# EAGLE design emonPi_V1.6 (EAGLE 7.3.0)
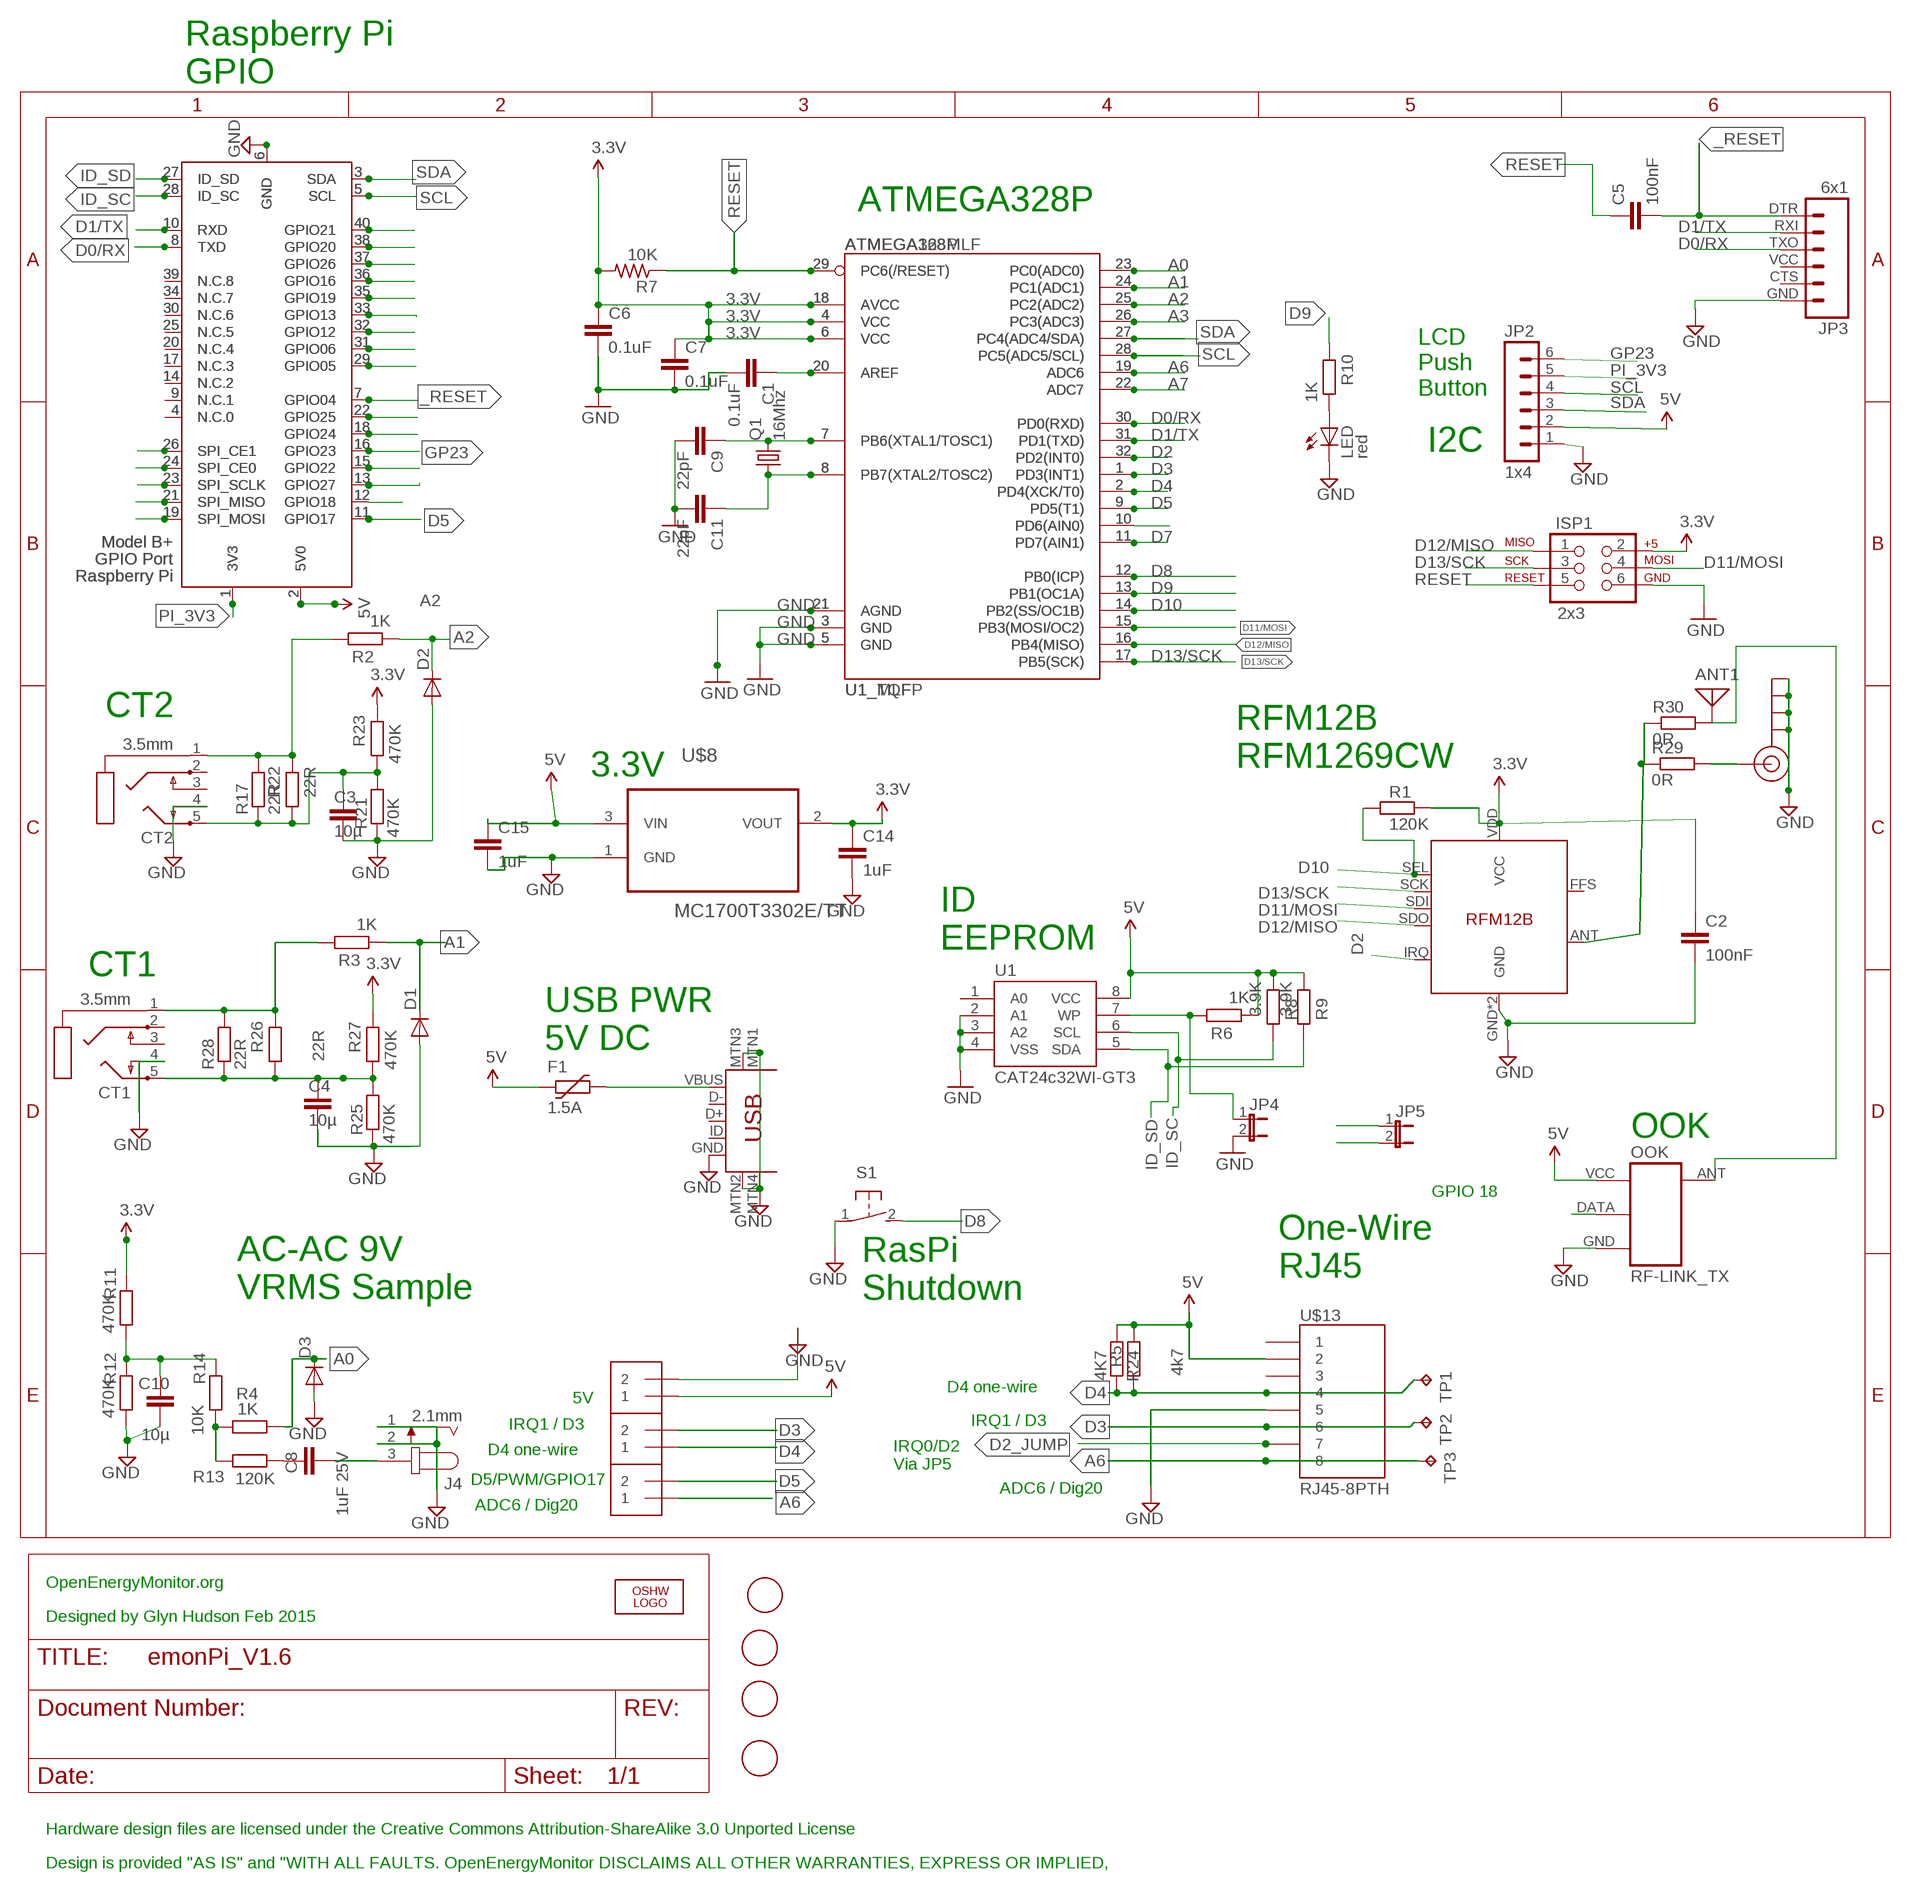
[diagram p0: schematic, sheet 1]

## Parts
ANT1  ANTENNA  [PAD-01]
C1  0.1uF  C-EUC0603  [C0603]
C2  100nF  C-EUC0603  [C0603]
C3  10µ  C-EUC0603  [C0603]
C4  10µ  C-EUC0603  [C0603]
C5  100nF  C-EUC0603  [C0603]
C6  0.1uF  C-EUC0603  [C0603]
C7  0.1uF  C-EUC0603  [C0603]
C8  1uF 25V  C-EUC0603  [C0603]
C9  22pF  C-EUC0603  [C0603]
C10  10µ  C-EUC0603  [C0603]
C11  22pF  C-EUC0603  [C0603]
C14  1uF  C-EUC0603  [C0603]
C15  1uF  C-EUC0603  [C0603]
CT1  3.5mm  STEREOJACK  [STX3100]
CT2  3.5mm  STEREOJACK  [STX3100]
D1  DIODE-SOD523  [SOD523]
D2  DIODE-SOD523  [SOD523]
D3  DIODE-SOD523  [SOD523]
F1  1.5A  FUSE_PTC-1812  [PTC1812L]
ISP1  2x3  AVR_SPI_PRG_6PTH  [2X3]
J1  1X2-3.5MM  [1X2-3.5MM]
J2  1X2-3.5MM  [1X2-3.5MM]
J3  1X2-3.5MM  [1X2-3.5MM]
J4  2.1mm  JACK-PLUG0  [SPC4077]
J$1  SMA_EDGE  [SMA-EDGE]
JP2  1x4  MA06-1  [MA06-1]
JP3  6x1  FTDI_BASICPTH  [FTDI_BASIC]
JP4  JUMPER-2PTH  [1X02]
JP5  JUMPER-2PTH  [1X02]
LED  red  LEDCHIPLED_0805  [CHIPLED_0805]
LOGO1  OSHW_LOGO_10MILX0200-NT  [OSHW_10X200_NOTEXT]
OOK  RF-LINK_TX  [RF-LINK_TX]
Q1  16Mhz  CRYSTALHC49UP  [HC49UP]
R1  120K  R-EU_R0603  [R0603]
R2  1K  R-EU_R0603  [R0603]
R3  1K  R-EU_R0603  [R0603]
R4  1K  R-EU_R0603  [R0603]
R5  4k7  R-EU_0204/7  [0204/7]
R6  1K  R-EU_R0603  [R0603]
R7  10K  R-US_R0603  [R0603]
R8  3.9K  R-EU_R0603  [R0603]
R9  3.9K  R-EU_R0603  [R0603]
R10  1K  R-EU_R0603  [R0603]
R11  470K  R-EU_R0603  [R0603]
R12  470K  R-EU_R0603  [R0603]
R13  120K  R-EU_R0603  [R0603]
R14  10K  R-EU_R0603  [R0603]
R17  22R  R-EU_R1206  [R1206]
R21  470K  R-EU_R0603  [R0603]
R22  22R  R-EU_0204/7  [0204/7]
R23  470K  R-EU_R0603  [R0603]
R24  4K7  R-EU_R0603  [R0603]
R25  470K  R-EU_R0603  [R0603]
R26  22R  R-EU_0204/7  [0204/7]
R27  470K  R-EU_R0603  [R0603]
R28  22R  R-EU_R1206  [R1206]
R29  0R  R-EU_R0603  [R0603]
R30  0R  R-EU_R0603  [R0603]
S1  31-XX  [B3F-31XX]
TP1  TPPAD1-13  [P1-13]
TP2  TPPAD1-13  [P1-13]
TP3  TPPAD1-13  [P1-13]
U1  CAT24c32WI-GT3  EEPROM-I2CSMD  [SO08]
U1_MLF  ATMEGA168MLF  [MLF32]
U1_TQFP  ATMEGA328P  ATMEGA328_SMT  [TQFP32-08]
U$1  FIDUCIAL  [FIDUCIAL_1MM]
U$3  FIDUCIAL  [FIDUCIAL_1MM]
U$4  FIDUCIAL  [FIDUCIAL_1MM]
U$5  FIDUCIAL  [FIDUCIAL_1MM]
U$7  USB-MINIB-5PIN  [USB-MINIB-CISECO]
U$8  MC1700T3302E/TT  MCP1700T-3302E/TT  [SOT95P237X112-3N]
U$13  RJ45-8PTH  [RJ45-8]
U$14  RFM12B  [RFM12B]
X1  RASPI_GPIO_B+_SMT  [RASPI_SMT_GPIO_B+_PIN]
X4  RASPI_GPIO_B+_PIN  [RASPI_GPIO_B+_PIN]

## Nets
3.3V [power]: C2.1 C6.1 C7.1 C14.1 ISP1.2 R1.2 R7.2 R11.2 R23.2 R27.2 U1_MLF.4(VCC) U1_MLF.6(VCC) U1_MLF.18(AVCC) U1_TQFP.4(VCC) U1_TQFP.6(VCC) U1_TQFP.18(AVCC) U$8.2(VOUT) U$14.VDD(VCC)
5V: C15.1 F1.1 J1.1 JP2.2 OOK.VCC(+5V) R5.2 R6.1 R8.1 R9.1 R24.1 U1.8(VCC) U$8.3(VIN) U$13.2 X1.2(5V0) X4.2(5V0)
_RESET: C5.2 JP3.DTR X1.7(GPIO04) X4.7(GPIO04)
A0: D3.C R4.1 U1_MLF.23(PC0(ADC0)) U1_TQFP.23(PC0(ADC0))
A1: D1.C R3.1 U1_MLF.24(PC1(ADC1)) U1_TQFP.24(PC1(ADC1))
A2: D2.C R2.1 U1_MLF.25(PC2(ADC2)) U1_TQFP.25(PC2(ADC2))
A3: U1_MLF.26(PC3(ADC3)) U1_TQFP.26(PC3(ADC3))
A6: J3.1 TP3.TP U1_MLF.19(ADC6) U1_TQFP.19(ADC6) U$13.8
A7: U1_MLF.22(ADC7) U1_TQFP.22(ADC7)
D0/RX: JP3.TXO U1_MLF.30(PD0(RXD)) U1_TQFP.30(PD0(RXD)) X1.8(TXD) X4.8(TXD)
D1/TX: JP3.RXI U1_MLF.31(PD1(TXD)) U1_TQFP.31(PD1(TXD)) X1.10(RXD) X4.10(RXD)
D2: JP5.1 U1_MLF.32(PD2(INT0)) U1_TQFP.32(PD2(INT0)) U$14.IRQ
D2_JUMP: JP5.2 U$13.7
D3: J2.2 TP2.TP U1_MLF.1(PD3(INT1)) U1_TQFP.1(PD3(INT1)) U$13.6
D4: J2.1 R5.1 R24.2 TP1.TP U1_MLF.2(PD4(XCK/T0)) U1_TQFP.2(PD4(XCK/T0)) U$13.4
D5: J3.2 U1_MLF.9(PD5(T1)) U1_TQFP.9(PD5(T1)) X1.11(GPIO17) X4.11(GPIO17)
D6: U1_MLF.10(PD6(AIN0)) U1_TQFP.10(PD6(AIN0))
D7: U1_MLF.11(PD7(AIN1)) U1_TQFP.11(PD7(AIN1))
D8: S1.2(S) U1_MLF.12(PB0(ICP)) U1_TQFP.12(PB0(ICP))
D9: R10.2 U1_MLF.13(PB1(OC1A)) U1_TQFP.13(PB1(OC1A))
D10: R1.1 U1_MLF.14(PB2(SS/OC1B)) U1_TQFP.14(PB2(SS/OC1B)) U$14.SEL
D11/MOSI: ISP1.4 U1_MLF.15(PB3(MOSI/OC2)) U1_TQFP.15(PB3(MOSI/OC2)) U$14.SDI
D12/MISO: ISP1.1 U1_MLF.16(PB4(MISO)) U1_TQFP.16(PB4(MISO)) U$14.SDO
D13/SCK: ISP1.3 U1_MLF.17(PB5(SCK)) U1_TQFP.17(PB5(SCK)) U$14.SCK
DIG6: R29.1 R30.1 U$14.ANT
GND [gnd]: C1.2 C2.2 C3.2 C4.2 C6.2 C7.2 C9.2 C10.2 C11.2 C14.2 C15.2 CT1.4 CT2.4 D1.A D2.A D3.A ISP1.6 J1.2 J4.1 J4.2 J$1.GND@0(GND) J$1.GND@1(GND) J$1.GND@2(GND) J$1.GND@3(GND) JP2.1 JP3.GND JP4.2 LED.C OOK.GND R12.1 R21.2 R25.2 S1.1(P) U1.2(A1) U1.3(A2) U1.4(VSS) U1_MLF.3(GND) U1_MLF.5(GND) U1_MLF.21(AGND) U1_TQFP.3(GND) U1_TQFP.5(GND) U1_TQFP.21(AGND) U$7.GND U$7.MTN1(MTN2) U$7.MTN2(MTN3) U$7.MTN3(MTN1) U$7.MTN4 U$8.1(GND) U$13.5 U$14.GND U$14.P$12(GND) X1.6(GND) X4.6(GND)
GP18: OOK.DATA X1.12(GPIO18) X4.12(GPIO18)
GP23: JP2.6 X1.16(GPIO23) X4.16(GPIO23)
ID_SC: R8.2 U1.6(SCL) X1.28(ID_SC) X4.28(ID_SC)
ID_SD: R9.2 U1.5(SDA) X1.27(ID_SD) X4.27(ID_SD)
N$1: C9.1 Q1.2 U1_MLF.7(PB6(XTAL1/TOSC1)) U1_TQFP.7(PB6(XTAL1/TOSC1))
N$2: C11.1 Q1.1 U1_MLF.8(PB7(XTAL2/TOSC2)) U1_TQFP.8(PB7(XTAL2/TOSC2))
N$3: C3.1 CT2.5 R17.1 R21.1 R22.1 R23.1
N$4: C8.1 R13.1
N$5: R4.2 R13.2 R14.1
N$12: CT1.1 R3.2 R26.2 R28.2
N$14: ANT1.1 OOK.ANT R30.2
N$15: C4.1 CT1.5 R25.1 R26.1 R27.1 R28.1
N$16: F1.2 U$7.VBUS
N$17: CT2.1 R2.2 R17.2 R22.2
N$18: C8.2 J4.3
N$20: C1.1 U1_MLF.20(AREF) U1_TQFP.20(AREF)
N$24: J$1.SIG(SIGNAL) R29.2
N$32: X1.13(GPIO27) X4.13(GPIO27)
N$33: X1.15(GPIO22) X4.15(GPIO22)
N$34: C10.1 R11.1 R12.2 R14.2
N$36: X1.18(GPIO24) X4.18(GPIO24)
N$37: X1.22(GPIO25) X4.22(GPIO25)
N$41: LED.A R10.1
N$42: X1.19(SPI_MOSI) X4.19(SPI_MOSI)
N$43: X1.21(SPI_MISO) X4.21(SPI_MISO)
N$44: X1.23(SPI_SCLK) X4.23(SPI_SCLK)
N$45: X1.24(SPI_CE0) X4.24(SPI_CE0)
N$46: X1.26(SPI_CE1) X4.26(SPI_CE1)
N$47: X1.4(N.C.0) X4.4(N.C.0)
N$48: X1.9(N.C.1) X4.9(N.C.1)
N$49: X1.14(N.C.2) X4.14(N.C.2)
N$50: X1.17(N.C.3) X4.17(N.C.3)
N$51: X1.20(N.C.4) X4.20(N.C.4)
N$52: X1.25(N.C.5) X4.25(N.C.5)
N$55: X1.29(GPIO05) X4.29(GPIO05)
N$56: X1.31(GPIO06) X4.31(GPIO06)
N$57: X1.32(GPIO12) X4.32(GPIO12)
N$58: X1.33(GPIO13) X4.33(GPIO13)
N$59: X1.35(GPIO19) X4.35(GPIO19)
N$60: X1.36(GPIO16) X4.36(GPIO16)
N$61: X1.37(GPIO26) X4.37(GPIO26)
N$62: X1.38(GPIO20) X4.38(GPIO20)
N$63: X1.40(GPIO21) X4.40(GPIO21)
N$64: X1.30(N.C.6) X4.30(N.C.6)
N$65: X1.34(N.C.7) X4.34(N.C.7)
N$66: X1.39(N.C.8) X4.39(N.C.8)
N$67: JP4.1 R6.2 U1.7(WP)
PI_3V3: JP2.5 X1.1(3V3) X4.1(3V3)
RESET: C5.1 ISP1.5 R7.1 U1_MLF.29(PC6(/RESET)) U1_TQFP.29(PC6(/RESET))
SCL: JP2.4 U1_MLF.28(PC5(ADC5/SCL)) U1_TQFP.28(PC5(ADC5/SCL)) X1.5(SCL) X4.5(SCL)
SDA: JP2.3 U1_MLF.27(PC4(ADC4/SDA)) U1_TQFP.27(PC4(ADC4/SDA)) X1.3(SDA) X4.3(SDA)
Unconnected: CT1.2 CT1.3 CT2.2 CT2.3 JP3.CTS JP3.VCC U1.1(A0) U$7.D+ U$7.D- U$7.ID U$13.1 U$13.3 U$14.FFS

## Notes on the sheet
- Raspberry Pi
  GPIO
- ATMEGA328P
- LCD 
  Push
  Button
- I2C
- CT2
- RFM12B
  RFM1269CW
- 3.3V
- ID
  EEPROM
- CT1
- USB PWR 
  5V DC
- OOK
- GPIO 18
- One-Wire
  RJ45
- AC-AC 9V 
  VRMS Sample
- RasPi
  Shutdown
- 5V | D4 one-wire
- IRQ1 / D3 | IRQ1 / D3
- D4 one-wire
- IRQ0/D2
  Via JP5
- D5/PWM/GPIO17
- ADC6 / Dig20
- ADC6 / Dig20
- OpenEnergyMonitor.org
- Designed by Glyn Hudson Feb 2015
- Hardware design files are licensed under the Creative Commons Attribution-ShareAlike 3.0 Unported License
- Design is provided "AS IS" and "WITH ALL FAULTS. OpenEnergyMonitor DISCLAIMS ALL OTHER WARRANTIES, EXPRESS OR IMPLIED,

## Library data of the parts
ANT1 = discrete:ANTENNA: Antenna
C1 C7 C9 C11 = resistor:C-EU: CAPACITOR, European symbol
C2-C6 C8 C10 C14 C15 = rcl:C-EU: CAPACITOR, European symbol
CT1 CT2 = adafruit:STEREOJACK: MIC/HEADPHONE JACK Stereo jack with two switches. Kycon STX3100, CUI SJ1-3555NG and/or 4UCon 05544
D1-D3 = diode:DIODE-: DIODE
F1 = dp_devices:FUSE_PTC: Resettable PTC
ISP1 = SparkFun:AVR_SPI_PRG_6: AVR ISP 6 Pin This is the reduced ISP connector for AVR programming. Common on Arduino. This footprint will take up less PCB space and can be used with a 10-pin to 6-pin adapter such as SKU: BOB-08508
J1-J3 = adafruit:1X2: 3.5mm Terminal block http://www.ladyada.net/library/pcb/eaglelibrary.html
J4 = con-jack:JACK-PLUG: DC POWER JACK Power Jack, DC, Right Angle, Through Hole, Rated 5A at 16VDC, PC Terminals Distributor: Farnell (www.Farnell.de) Drawing: 84N1161.pdf / 84N1162.pdf Manufacturer: SPC Technology (www.spctechnology.com) Type: SPC4077 / SPC 4078; OC_FARNELL: unknown; OC_NEWARK: unknown
J$1 = SparkFun-Connectors:SMA_EDGE: SMA Antenna Connector End launch SMA connector. The paste layer has been removed so that the connector can be hand soldered onto the board after reflow.
JP2 = con-lstb:MA06-1: PIN HEADER; OC_FARNELL: unknown; OC_NEWARK: unknown
JP3 = SparkFun:FTDI_BASIC: FTDI Basic: 3.3V and 5V
JP4 JP5 = SparkFun-Passives:JUMPER-2: Jumper Basic 0.1" spaced jumper. Use with breakaway headers.
LED = led:LED: LED OSRAM: - CHIPLED LG R971, LG N971, LY N971, LG Q971, LY Q971, LO R971, LY R971 LH N974, LH R974 LS Q976, LO Q976, LY Q976 LO Q996 - Hyper CHIPLED LW Q18S LB Q993, LB Q99A, LB R99A - SideLED LS A670, LO A670, LY A670, LG A670, LP A670 LB A673, LV A673, LT A673, LW A673 LH A674 LY A675 LS A676, LA A676, LO A676, LY A676, LW A676 LS A679, LY A679, LG A679 - Hyper Micro SIDELED® LS Y876, LA Y876, LO Y876, LY Y876 LT Y87S - SmartLED LW L88C, LW L88S LB L89C, LB L89S, LG L890 LS L89K, LO L89K, LY L89K LS L896, LA L896, LO L896, LY L896 - TOPLED LS T670, LO T670, LY T670, LG T670, LP T670 LSG T670, LSP T670, LSY T670, LOP T670, LYG T670 LG T671, LOG T671, LSG T671 LB T673, LV T673, LT T673, LW T673 LH T674 LS T676, LA T676, LO T676, LY T676, LB T676, LH T676, LSB T676, LW T676 LB T67C, LV T67C, LT T67C, LS T67K, LO T67K, LY T67K, LW E67C LS E67B, LA E67B, LO E67B, LY E67B, LB E67C, LV E67C, LT E67C LW T67C LS T679, LY T679, LG T679 LS T770, LO T770, LY T770, LG T770, LP T770 LB T773, LV T773, LT T773, LW T773 LH T774 LS E675, LA E675, LY E675, LS T675 LS T776, LA T776, LO T776, LY T776, LB T776 LHGB T686 LT T68C, LB T68C - Hyper Mini TOPLED® LB M676 - Mini TOPLED Santana® LG M470 LS M47K, LO M47K, LY M47K Source: http://www.osram.convergy.de LUXEON: - LUMILED® LXK2-PW12-R00, LXK2-PW12-S00, LXK2-PW14-U00, LXK2-PW14-V00 LXK2-PM12-R00, LXK2-PM12-S00, LXK2-PM14-U00 LXK2-PE12-Q00, LXK2-PE12-R00, LXK2-PE12-S00, LXK2-PE14-T00, LXK2-PE14-U00 LXK2-PB12-K00, LXK2-PB12-L00, LXK2-PB12-M00, LXK2-PB14-N00, LXK2-PB14-P00, LXK2-PB14-Q00 LXK2-PR12-L00, LXK2-PR12-M00, LXK2-PR14-Q00, LXK2-PR14-R00 LXK2-PD12-Q00, LXK2-PD12-R00, LXK2-PD12-S00 LXK2-PH12-R00, LXK2-PH12-S00 LXK2-PL12-P00, LXK2-PL12-Q00, LXK2-PL12-R00 Source: www.luxeon.com KINGBRIGHT: KA-3528ASYC Source: www.kingbright.com
LOGO1 = ohw-logo:OSHW_LOGO_10MIL
OOK = SparkFun-RF:RF-LINK_TX: RF Link transmitters WRL-8945, 8946
Q1 = adafruit:CRYSTAL: CRYSTAL; OC_FARNELL: unknown; OC_NEWARK: unknown
R1-R6 R8-R14 R17 R21-R28 = rcl:R-EU_: RESISTOR, European symbol
R7 = adafruit:R-US_: RESISTOR, American symbol
R29 R30 = resistor:R-EU_: RESISTOR, European symbol
S1 = adafruit:31-XX: OMRON SWITCH Now with beefier pads!
TP1-TP3 = testpad:TP: Test pad
U1 = SparkFun-DigitalIC:EEPROM-I2C: I2C EEPROM chips, 24LC256 (and others)
U1_MLF = SparkFun-DigitalIC:ATMEGA168: Atmel 32-pin 8-bit micro, 16k flash.
U1_TQFP = SparkFun-DigitalIC:ATMEGA328_SMT: 32-Pin Atmega328 part Commonly used on Arduino compatible boards Available in QFP and QFN packages TQFP is IC-09069 QFN is non-stock; PROD_ID: IC-09069
U$1 U$3-U$5 = adafruit:FIDUCIAL: For use by pick and place machines to calibrate the vision/machine, 1mm By microbuilder.eu
U$7 = Ciseco USB miniB_Updated:USB-MINIB: Mini-USB "B" connector with 5th pin broken out. Created new symbol breaking out 5th "ID" pin in mini/micro USB connector spec. See: http://en.wikipedia.org/wiki/Mini_usb#Cables. Uses same footprint as 4-pin symbol. Also added pins to connect to mounting / shield pads if required (probably not generally needed as signals aren't shielded once they leave the connector). Modified by Ciseco for Rapid Part 24-0357
U$8 = Farnell_MCP1700-1202:MCP1700T-3302E/TT: 1.2V Low Quiescent Current LDO; MPN: MCP1700T-1202E/TT; OC_FARNELL: 1851940RL; PACKAGE: SOT23-3; SUPPLIER: Microchip
U$13 = SparkFun-Connectors:RJ45-8: RJ45 Jack Simple RJ45, 8-pin connection - connector for common Cat5, Cat5e, and Cat6 Ethernet cables. Footprint not yet proven in production. Connector sku is PRT-00643; Breakout PCB sku is BOB-00716.
U$14 = JeeParts:RFM12B
X1 X4 = raspberrypi_bastelstube_v13:RASPI_GPIO_B+: Only the 2x20 header connector, nothing else

## Net classes
0 default: width 0.203 mm, drill 0.6 mm, clearance 0.203 mm
1 power: width 0.305 mm, drill 0.6 mm, clearance 0.254 mm
2 gnd: width 0.254 mm, drill 0.6 mm, clearance 0.254 mm
3 5V0_PI: width 0.406 mm, drill 0.4 mm
4 3V3_PI: width 0.254 mm, drill 0.4 mm

## Board
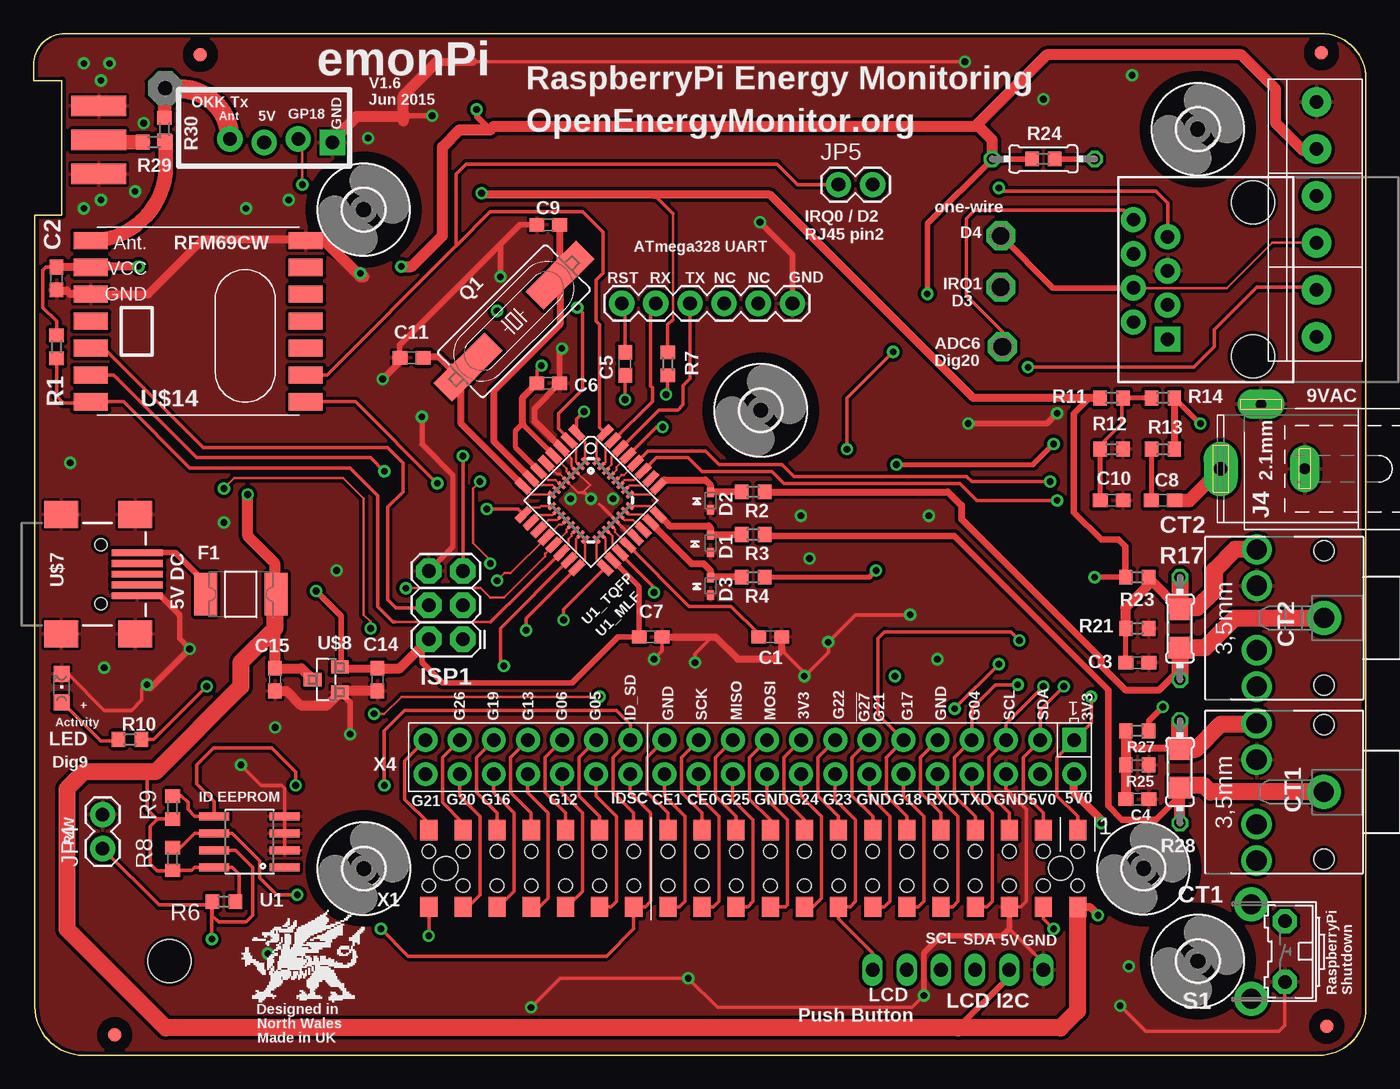
[diagram p1: board, top side]
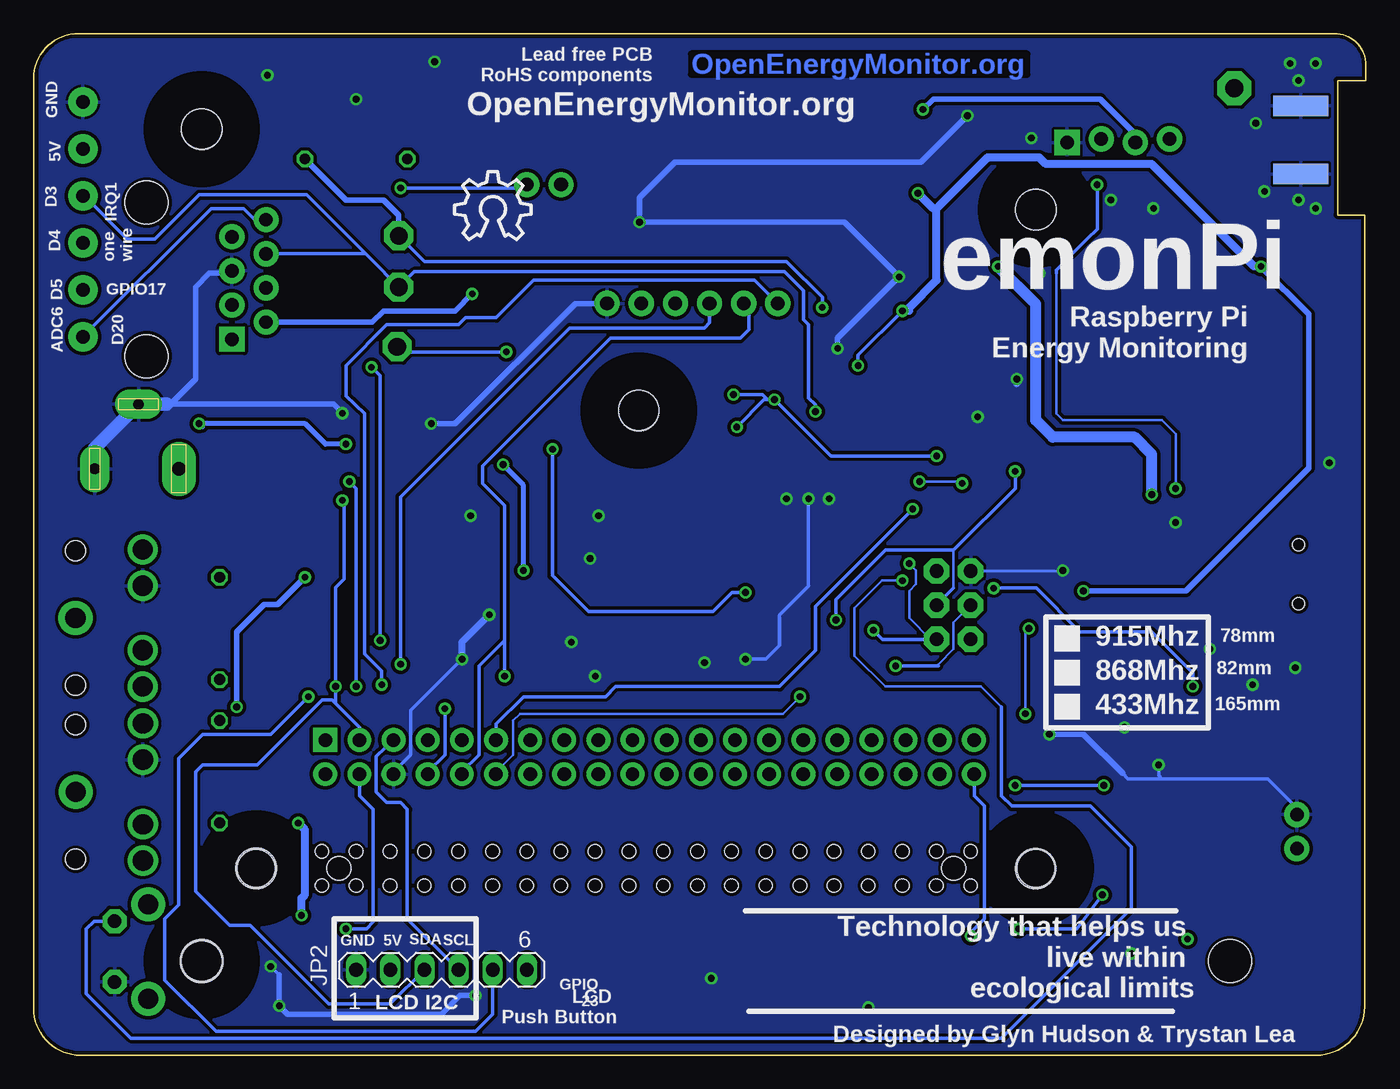
[diagram p2: board, bottom side, seen from below]

Size 99.1 x 76 mm. Coordinates in mm from the lower left corner, seen from the top.
Outline: 0.1,62.5 0.1,3.59 arc90 3.69,0 95.6,0 arc90 99.1,3.5 99.1,72.65 arc90 95.75,76 2.34,76 arc90 0,73.66 0,72.5 2.1,72.5 2.1,62.5 0.1,62.5
Copper layers (1*16): Top 8mil / dielectric 8mil / Bottom 8mil
Design rules "default *": minimum track width 8mil, minimum drill 0.5mm, track to track 8mil, track to pad 8mil, pad to pad 8mil, via to via 8mil, smd to smd 8mil, copper to edge 10mil, drill to drill 8mil, minimum pad ring 8mil, minimum via ring 8mil, stop-mask expansion 0.075mm, vias tented up to drill 0.6mm, thermal gap 8mil
Holes 3.2 mm at 10.1,7 86.6,7
Holes 3 mm at 86.6,68.9 54.09,47.96
Holes 2.8 mm at 24.56,13.89 82.55,13.89
tKeepout: area -8.4,0 to 95.6,3; area -5.6,73 to 98.4,76

### Footprints (pad centres in the part's own frame; a part is rotated, then mirrored left to right if it is on the bottom)
PAD-01 = drill 1.321 pad 2.54 octagon: 1 0,0
C0603 = smd 1.1 x 1: 1 -0.85,0; 2 0.85,0
STX3100 = drill 1.5 pad 2.54: 1 2.7,-0.1 | drill 1.5: 2 7.7,5; 3 7.7,2.3; 4 7.7,-2.5; 5 7.7,-5.2 | hole 1.5: 2.7,4.9; 2.7,-5.1
SOD523 = smd 0.7 x 0.5: A 0.7,0; C -0.6,0
PTC1812L = smd 1.7 x 3.15: 1 -2.62,0; 2 2.62,0
2X3 = drill 1.016 pad 1.88 octagon: 1 0,0; 2 0,2.54; 3 2.54,0; 4 2.54,2.54; 5 5.08,0; 6 5.08,2.54
1X2-3.5MM = drill 1 pad 2.184: 1 1.8,0; 2 -1.7,0
SPC4077 = drill 0.8 pad 2.184 long: 1 -3.25,0; 2 0,-4.8 | drill 1 pad 2.54 long: 3 3,0
SMA-EDGE = smd 1.524 x 4.064: GND@0 0,0; GND@1 5.08,0; SIG 2.54,0 | smd 1.524 x 4.064 bottom: GND@2 0,0; GND@3 5.08,0
MA06-1 = drill 1.016 long: 1 -6.35,0; 2 -3.81,0; 3 -1.27,0; 4 1.27,0; 5 3.81,0; 6 6.35,0
FTDI_BASIC = drill 1.016 pad 1.88: CTS 10.16,0; DTR 0,0; GND 12.7,0; RXI 2.54,0; TXO 5.08,0; VCC 7.62,0
1X02 = drill 1.016 pad 1.88: 1 0,0; 2 2.54,0
CHIPLED_0805 = smd 1.2 x 1.2: A 0,-1.05; C 0,1.05
RF-LINK_TX = drill 1.016 pad 1.88: ANT 7.62,-0.127; DATA 2.54,-0.127; VCC 5.08,0.127 | drill 1.016 pad 1.88 square: GND 0,0.127
HC49UP = smd 5.334 x 1.93: 1 -4.826,0; 2 4.826,0
R0603 = smd 1 x 1.1: 1 -0.85,0; 2 0.85,0
0204/7 = drill 0.813 octagon: 1 -3.81,0; 2 3.81,0
R1206 = smd 1.6 x 1.803: 1 -1.422,0; 2 1.422,0
B3F-31XX = drill 1.016 pad 1.778 octagon: 1 -2.261,-1.245; 2 2.261,-1.245 | drill 1.499 pad 2.54: 3 -3.505,1.245; 4 3.505,1.245
P1-13 = drill 1.321 pad 2.159 octagon: TP 0,0
SO08 = smd 0.61 x 2.21: 1 -1.905,-2.616; 2 -0.635,-2.616; 3 0.635,-2.616; 4 1.905,-2.616; 5 1.905,2.616; 6 0.635,2.616; 7 -0.635,2.616; 8 -1.905,2.616
MLF32 = smd 0.7 x 0.3: 1 -2.35,1.75; 2 -2.35,1.25; 3 -2.35,0.75; 4 -2.35,0.25; 5 -2.35,-0.25; 6 -2.35,-0.75; 7 -2.35,-1.25; 8 -2.35,-1.75; 17 2.35,-1.75; 18 2.35,-1.25; 19 2.35,-0.75; 20 2.35,-0.25; 21 2.35,0.25; 22 2.35,0.75; 23 2.35,1.25; 24 2.35,1.75 | smd 0.3 x 0.7: 9 -1.75,-2.35; 10 -1.25,-2.35; 11 -0.75,-2.35; 12 -0.25,-2.35; 13 0.25,-2.35; 14 0.75,-2.35; 15 1.25,-2.35; 16 1.75,-2.35; 25 1.75,2.35; 26 1.25,2.35; 27 0.75,2.35; 28 0.25,2.35; 29 -0.25,2.35; 30 -0.75,2.35; 31 -1.25,2.35; 32 -1.75,2.35
TQFP32-08 = smd 1.27 x 0.559: 1 -4.293,2.8; 2 -4.293,2; 3 -4.293,1.2; 4 -4.293,0.4; 5 -4.293,-0.4; 6 -4.293,-1.2; 7 -4.293,-2; 8 -4.293,-2.8; 17 4.293,-2.8; 18 4.293,-2; 19 4.293,-1.2; 20 4.293,-0.4; 21 4.293,0.4; 22 4.293,1.2; 23 4.293,2; 24 4.293,2.8 | smd 0.559 x 1.27: 9 -2.8,-4.293; 10 -2,-4.293; 11 -1.2,-4.293; 12 -0.4,-4.293; 13 0.4,-4.293; 14 1.2,-4.293; 15 2,-4.293; 16 2.8,-4.293; 25 2.8,4.293; 26 2,4.293; 27 1.2,4.293; 28 0.4,4.293; 29 -0.4,4.293; 30 -1.2,4.293; 31 -2,4.293; 32 -2.8,4.293
FIDUCIAL_1MM = smd 1 x 1: 1 0,0
3,0 = hole 3: 0,0
USB-MINIB-CISECO = smd 3.8 x 0.5: D+ 7.9,0; D- 7.9,0.8; GND 7.9,-1.6; ID 7.9,-0.8; VBUS 7.9,1.6 | smd 2.5 x 2: MTN1 2.25,4.45; MTN2 7.75,4.45; MTN3 2.25,-4.45; MTN4 7.75,-4.45 | hole 0.9: 5.2,2.2; 5.2,-2.2
SOT95P237X112-3N = smd 0.991 x 1.321: 1 -0.94,-1.016; 2 0.94,-1.016; 3 0,1.016
RJ45-8 = drill 1 pad 1.88 square: 1 -4.445,6.35 | drill 1 pad 1.88: 2 -3.175,8.89; 3 -1.905,6.35; 4 -0.635,8.89; 5 0.635,6.35; 6 1.905,8.89; 7 3.175,6.35; 8 4.445,8.89 | hole 3.2: -5.715,0; 5.715,0
RFM12B = smd 2.54 x 1.27: ANT 8,-6; FFS -8,2; GND 8,-2; IRQ -8,4; P$8 -8,0; P$9 -8,-2; P$10 -8,-4; P$12 -8,-6; P$16 8,0; SCK 8,4; SDI 8,2; SDO -8,6; SEL 8,6; VDD 8,-4
RASPI_SMT_GPIO_B+_PIN = smd 1.27 x 1.5: 1 -24.13,-2.857; 2 -24.13,2.857; 3 -21.59,-2.857; 4 -21.59,2.857; 5 -19.05,-2.857; 6 -19.05,2.857; 7 -16.51,-2.857; 8 -16.51,2.857; 9 -13.97,-2.857; 10 -13.97,2.857; 11 -11.43,-2.857; 12 -11.43,2.857; 13 -8.89,-2.857; 14 -8.89,2.857; 15 -6.35,-2.857; 16 -6.35,2.857; 17 -3.81,-2.857; 18 -3.81,2.857; 19 -1.27,-2.857; 20 -1.27,2.857; 21 1.27,-2.857; 22 1.27,2.857; 23 3.81,-2.857; 24 3.81,2.857; 25 6.35,-2.857; 26 6.35,2.857; 27 8.89,-2.857; 28 8.89,2.857; 29 11.43,-2.857; 30 11.43,2.857; 31 13.97,-2.857; 32 13.97,2.857; 33 16.51,-2.857; 34 16.51,2.857; 35 19.05,-2.857; 36 19.05,2.857; 37 21.59,-2.857; 38 21.59,2.857; 39 24.13,-2.857; 40 24.13,2.857 | hole 1.778: -22.86,0; 22.86,0 | hole 1: -24.13,1.27; -24.13,-1.27; -21.59,-1.27; -21.59,1.27; -19.05,1.27; -19.05,-1.27; -16.51,-1.27; -16.51,1.27; -13.97,1.27; -13.97,-1.27; -11.43,-1.27; -11.43,1.27; -8.89,1.27; -8.89,-1.27; -6.35,-1.27; -6.35,1.27; -3.81,1.27; -3.81,-1.27; -1.27,-1.27; -1.27,1.27; 1.27,1.27; 1.27,-1.27; 3.81,-1.27; 6.35,-1.27; 8.89,-1.27; 11.43,-1.27; 13.97,-1.27; 16.51,-1.27; 19.05,-1.27; 21.59,-1.27; 24.13,-1.27; 24.13,1.27; 21.59,1.27; 19.05,1.27; 16.51,1.27; 13.97,1.27; 11.43,1.27; 8.89,1.27; 6.35,1.27; 3.81,1.27
RASPI_GPIO_B+_PIN = drill 1 pad 1.778 square: 1 -24.13,-1.27 | drill 1 pad 1.778: 2 -24.13,1.27; 3 -21.59,-1.27; 4 -21.59,1.27; 5 -19.05,-1.27; 6 -19.05,1.27; 7 -16.51,-1.27; 8 -16.51,1.27; 9 -13.97,-1.27; 10 -13.97,1.27; 11 -11.43,-1.27; 12 -11.43,1.27; 13 -8.89,-1.27; 14 -8.89,1.27; 15 -6.35,-1.27; 16 -6.35,1.27; 17 -3.81,-1.27; 18 -3.81,1.27; 19 -1.27,-1.27; 20 -1.27,1.27; 21 1.27,-1.27; 22 1.27,1.27; 23 3.81,-1.27; 24 3.81,1.27; 25 6.35,-1.27; 26 6.35,1.27; 27 8.89,-1.27; 28 8.89,1.27; 29 11.43,-1.27; 30 11.43,1.27; 31 13.97,-1.27; 32 13.97,1.27; 33 16.51,-1.27; 34 16.51,1.27; 35 19.05,-1.27; 36 19.05,1.27; 37 21.59,-1.27; 38 21.59,1.27; 39 24.13,-1.27; 40 24.13,1.27

### Placement (x,y rotation side)
ANT1  9.79,71.93 0 top
C1  54.79,31.11 0 top
C2  1.7,57.78 270 top
C3  82.09,29.21 0 top
C4  82.09,19.05 0 top
C5  44,51.44 90 top
C6  38.28,49.99 0 top
C7  45.9,31.11 0 top
C8  84,41.27 0 top
C9  38.28,61.77 180 top
C10  80.19,41.27 0 top
C11  28.12,51.9 180 top
C14  25.58,27.94 270 top
C15  17.96,27.94 270 top
CT1  98.67,19.48 180 top
CT2  98.68,32.43 180 top
D1  50.34,38.1 270 top
D2  50.34,41.27 270 top
D3  50.34,34.92 270 top
F1  15.42,34.29 180 top
ISP1  31.93,30.94 90 top
J1  95.43,69.22 270 top
J2  95.43,62.23 270 top
J3  95.43,55.24 270 top
J4  91.3,43.62 180 top
J$1  4.84,65.55 90 top
JP2  68.76,6.35 0 bottom
JP3  43.74,55.93 0 top
JP4  5.13,15.37 90 top
JP5  59.87,64.77 0 top
LED  2.08,27.3 0 top
LOGO1  67.78,60.66 0 bottom
OOK  22.22,68.03 180 top
Q1  35.74,54.61 45 top
R1  1.7,52.7 90 top
R2  53.52,41.91 0 top
R3  53.52,38.73 0 top
R4  53.52,35.56 0 top
R5  75.11,66.67 180 top
R6  14.15,11.43 180 top
R7  47.17,51.44 90 top
R8  10.34,14.61 90 top
R9  10.34,18.41 90 top
R10  7.16,23.5 0 top
R11  80.19,48.9 180 top
R12  80.19,45.09 180 top
R13  84,45.09 0 top
R14  84,48.9 180 top
R17  85.27,31.75 270 top
R21  82.09,31.75 0 top
R22  85.27,31.75 270 top
R23  82.09,35.56 180 top
R24  75.11,66.67 0 top
R25  82.09,21.59 0 top
R26  85.27,21.08 270 top
R27  82.09,24.13 0 top
R28  85.27,21.34 270 top
R29  8.99,67.92 180 top
R30  9.74,68.89 90 top
S1  91.83,7.71 90 top
TP1  71.93,60.96 0 top
TP2  71.93,57.15 0 top
TP3  72.06,52.7 0 top
U1  16.05,15.88 90 top
U1_MLF  41.45,41.27 315 top
U1_TQFP  41.45,41.27 315 top
U$1  12.4,74.45 0 top
U$2  [3,0]  24.55,62.9 0 top
U$3  95.8,74.56 90 top
U$4  96.19,2.15 0 top
U$5  6.03,1.53 0 top
U$6  [3,0]  86.59,68.89 0 top
U$7  -0.2,35.78 0 top
U$8  21.77,27.94 90 top
U$9  [3,0]  86.6,7 0 top
U$10  [3,0]  86.59,68.89 0 top
U$11  [3,0]  82.55,13.9 0 top
U$12  [3,0]  54.09,47.97 0 top
U$13  90.7,57.72 90 top
U$14  12.24,54.61 180 top
U$15  [3,0]  24.56,13.89 0 top
X1  53.53,13.89 180 top
X4  53.28,22.18 180 top

### Tracks (layer width: path | path; a pad name or v marks a point on that pad's centre or on a via)
3.3V  (via drill 0.5)
  Top 0.203: U1_MLF.6 39.21,42.41 38.84,42.77 38.26,42.77 U1_TQFP.6 | U1_MLF.18 42.27,38.73 42.55,38.46 42.55,37.35 U1_TQFP.18 | U1_TQFP.4 39.65,43.64 39.65,43.43 U1_MLF.4 | 36.5,46.79 36.25,46.86 36.38,46.99 | 47.55,54.74 47.55,62.61
  Top 0.254: R7.2 47.17,54.36 47.55,54.74 | 47.55,62.61 46.15,64.01 | C6.1 37.43,50.97 v37.77,51.31 | C2.1 0.9,58.63 0.69,58.42 0.69,55.63 1.7,54.61 R1.2
  Top 0.381: 37.57,43.51 35.87,45.21 35.87,46.48 36.25,46.86 | 38.7,44.66 U1_TQFP.4 36.5,46.79 | 44.87,35.03 U1_TQFP.18
  Top 0.406: R27.2 82.94,24.85 v84,25.91 | v78.92,35.56 R23.2 | 44.87,35.03 45.05,34.85 C7.1 43.49,31.11 40.06,27.69 30.41,27.69 28.88,29.21 28.88,30.43 | 22.88,28.79 22.88,32.68 v21.01,34.54
  Top 0.483: R11.2 78.54,48.9 77.4,47.75 77.4,40.39 79.43,38.35 80.7,38.35 81.21,37.85 81.21,35.6 R23.2 | 33.45,64.01 v33.33,64.14
  Top 0.508: 36.38,46.99 36.38,48.94 C6.1 | U1_TQFP.6 37.57,43.51
  Top 0.61: R11.2 69.9,48.9 54.79,64.01 46.15,64.01 33.45,64.01 | v7.8,58.67 4.31,58.67 U$14.VDD 1.47,58.61 C2.1 | 22.88,28.79 C14.1
  Top 0.762: C14.1 27.24,28.79 ISP1.2 | 22.88,28.79 U$8.2
  Top 0.813: 28.88,30.43 ISP1.2
  Bottom 0.254: v37.77,51.31 37.77,52.07 v34.47,55.37
  Bottom 0.406: v84,25.91 84,31.5 81.97,33.53 80.95,33.53 v78.92,35.56 | v21.01,34.54 13.39,34.54 4.24,43.69 4.24,55.12 v7.8,58.67
  Bottom 0.483: v34.47,55.37 33.96,55.37
  Bottom 0.61: v7.8,58.67 8.31,58.67 15.93,66.29 23.8,66.29 24.31,66.8 28.12,66.8 31.93,62.99 | 33.96,55.37 33.96,55.63 31.93,57.66 31.93,62.99 | 31.93,62.99 32.18,62.99 v33.33,64.14
5V  (via drill 0.5)
  Top 0.254: R6.1 15.29,11.72 15.29,13.46 14.78,13.97 U1.8 11.99,13.97 11.78,13.76 R8.1 10.3,13.72 9.2,13.72 8.69,14.22 8.69,17.02 9.24,17.57 R9.1 9.16,17.57 8.44,18.29 8.44,20.95 8.56,21.08 | X1.2 77.66,9.92 77.65,9.91
  Top 0.406: v66.47,56.64 66.47,61.85 R5.2 R24.1 | 17.96,34.37 F1.1 | JP2.2 72.57,5.84 68.76,2.03 | v32.95,70.36 32.95,69.85 33.96,68.83
  Top 0.61: X1.2 78.55,11.04 v79.17,10.41 | v79.43,17.27 79.43,17.53 77.4,19.56 77.4,20.9 X4.2
  Top 0.762: C15.1 19.9,28.79 U$8.3
  Top 0.813: C15.1 17.96,31.75 | 17.96,34.37 17.96,36.58 15.93,38.61 v15.93,41.7 | J1.1 95.32,67.31 94.41,67.31 92.38,69.34 92.38,71.88 89.84,74.42 75.36,74.42 70.16,69.22 | v27.36,58.67 28.12,58.67 30.41,60.96 30.41,67.56 31.68,68.83 33.96,68.83 34.22,69.09 70.03,69.09 70.16,69.22 | R5.2 71.3,68.07 70.16,69.22
  Top 1.27: 77.65,10.41 77.65,9.91 77.65,3.3 76.38,2.03 68.76,2.03 9.83,2.03 2.47,9.4 2.47,19.81 3.74,21.08 8.56,21.08 9.07,21.08 15.42,27.43 15.42,29.21 17.96,31.75 17.96,34.21 F1.1
  Bottom 0.406: v66.47,56.64 67.74,55.37 73.08,55.37 73.91,54.54 U$13.2 | OOK.VCC 17.14,68.53 19.74,71.12 32.18,71.12 v32.95,70.36
  Bottom 0.61: v79.17,10.41 79.17,11.68 78.92,11.94 78.92,16.76 v79.43,17.27
  Bottom 0.813: v27.36,58.67 24.56,55.88 24.56,47.24 23.29,45.97 17.2,45.97 15.93,44.7 v15.93,41.7
_RESET  (via drill 0.5)
  Top 0.254: C5.2 44,55.67 JP3.DTR | v73.2,27.56 71.55,27.56 69.78,25.78 69.79,25.77 X4.7 68.51,22.17 68.51,19.3 70.04,17.77 X1.7
  Bottom 0.254: JP3.DTR 45.47,57.66 61.9,57.66 64.7,54.86 66.98,54.86 67.49,54.36 72.82,54.36 75.87,51.31 75.87,49.02 74.47,47.75 74.47,29.84 73.2,28.57 v73.2,27.56
A0
  Top 0.203: U1_MLF.23 44.01,40.5 44.27,40.23 45.33,40.23 U1_TQFP.23
  Top 0.508: U1_TQFP.23 45.91,39.62 48.95,36.58 49.84,36.58 50.34,36.07 D3.C 50.38,35.56 R4.1
A1
  Top 0.203: 47.3,39.37 47.3,39.39 | U1_MLF.24 45.84,40.85 U1_TQFP.24
  Top 0.381: 52.63,38.7 R3.1
  Top 0.508: 46.47,40.2 U1_TQFP.24 47.3,39.39 | 47.3,39.37 50.22,39.37 50.34,39.24 D1.C 52.63,38.7
A2
  Top 0.203: U1_MLF.25 45.84,41.7 U1_TQFP.25
  Top 0.508: U1_TQFP.25 46.47,42.35 46.92,42.8 49.96,42.8 50.34,42.42 D2.C 50.38,41.91 R2.1
A3
  Top 0.203: U1_MLF.26 44.01,42.05 44.33,42.37 45.38,42.37 U1_TQFP.26
A6  (via drill 0.5)
  Top 0.203: 42.9,38.76 U1_MLF.19 43.05,38.61 43.05,38 43.64,37.41 U1_TQFP.19
  Top 0.254: U1_TQFP.19 43.82,37.39 43.82,37.14 46.03,34.92 46.03,34.54 v46.15,34.42 | v60.51,45.09 60.51,48.9 v63.93,52.32 | TP3.TP 72.06,53.85 69.39,56.52 69.39,62.23 70.03,62.87 81.1,62.87 U$13.8
  Bottom 0.254: v60.51,45.09 60.51,35.69 57.84,33.02 48.57,33.02 47.17,34.42 v46.15,34.42 | v63.93,52.32 71.68,52.32 TP3.TP | U$13.8 82.66,62.16 83.49,62.99 85.88,62.99 J3.1
A7
  Top 0.203: U1_MLF.22 43.97,39.83 44.6,39.83 U1_TQFP.22
D0/RX  (via drill 0.5)
  Top 0.203: U1_MLF.30 42.59,43.52 43,43.94 43,44.52 U1_TQFP.30
  Top 0.254: JP3.TXO 48.82,50.34 48.31,49.83 48.31,48.39 47.93,48.01 46.54,48.01 43.69,45.16 U1_TQFP.30 | v71.81,29.08 v68.51,25.78 | X1.8 70.91,11.04 71.3,11.43 71.3,18.03 69.78,19.56 69.78,20.9 X4.8
  Bottom 0.254: v71.81,29.08 71.81,41.53 59.24,54.1 49.2,54.1 48.82,54.48 JP3.TXO | X4.8 69.79,21.07 68.51,22.35 v68.51,25.78
D1/TX  (via drill 0.5)
  Top 0.203: 42.27,43.82 U1_MLF.31 42.55,44.13 42.55,45.2 U1_TQFP.31
  Top 0.254: U1_TQFP.31 43.11,45.73 46.03,48.64 46.03,49.66 45.9,49.78 45.9,55.55 JP3.RXI 46.03,55.67 | X1.10 68.37,11.04 68.76,11.43 68.76,17.78 67.24,19.3 67.24,20.9 X4.10
  Bottom 0.254: JP3.RXI 45.9,55.55 45.9,53.98 46.54,53.34 56.19,53.34 65.71,43.81 65.71,42.55 64.06,40.89 64.06,30.86 | X4.10 67.25,21.07 65.97,22.35 65.97,28.96 64.06,30.86 | v64.06,28.19 64.06,30.86
D2
  Top 0.203: U1_MLF.32 41.88,45.66 U1_TQFP.32
  Top 0.254: U1_TQFP.32 42.09,46.71 42.09,54.36 41.84,54.61 41.84,57.66 42.34,58.17 42.34,61.21 40.82,62.74 33.96,62.74 31.42,60.2 | U$14.IRQ 21.83,50.61 31.3,60.07 31.42,60.2 | JP5.1 56.82,64.77 55.3,66.29 32.18,66.29 31.42,65.53 31.42,60.2
D2_JUMP  (via drill 0.5)
  Top 0.254: U$13.7 84.35,63.4 83.49,64.26 72.06,64.26 v71.81,64.52
  Bottom 0.254: v71.81,64.52 62.66,64.52 JP5.2
D3  (via drill 0.5)
  Top 0.203: U1_MLF.1 41.03,45.66 U1_TQFP.1
  Top 0.254: U1_TQFP.1 40.4,47.33 v40.95,47.88
  Bottom 0.254: v40.95,47.88 40.95,48.39 41.45,48.9 41.45,54.36 41.84,54.74 41.84,56.9 43.23,58.29 70.79,58.29 TP2.TP 74.03,59.24 74.41,59.62 | U$13.6 74.41,59.62 | J2.2 95.35,63.93 92.13,60.71 90.1,60.71 86.79,64.01 78.79,64.01 74.41,59.62
D4  (via drill 0.5)
  Top 0.203: U1_MLF.2 40.68,43.83 40.36,44.15 40.36,45.2 U1_TQFP.2 | U$13.4 88.76,57.08 92.13,60.45 95.41,60.45 J2.1
  Top 0.254: U1_TQFP.2 39.83,45.82 39.04,46.61 39.04,47.75 40.82,49.53 40.82,55.24 v40.44,55.63
  Top 0.406: U$13.4 75.81,57.08 TP1.TP | R5.1 R24.2
  Bottom 0.254: v40.44,55.63 40.44,56.39 43.11,59.05 70.03,59.05 TP1.TP
  Bottom 0.406: TP1.TP 71.93,62.48 73.08,63.63 75.87,63.63 R5.1
D5  (via drill 0.5)
  Top 0.203: U1_TQFP.9 36.49,40.22 37.01,40.74 37.62,40.74 37.73,40.85 U1_MLF.9
  Top 0.254: v33.71,40.64 36.02,40.64 U1_TQFP.9 | v73.33,30.86 72.7,31.5 63.3,31.5 62.79,30.99 62.79,25.37 X4.11 63.43,22.17 63.43,19.3 64.96,17.77 X1.11 | v73.97,51.18 86.29,51.18 87.81,52.7 87.81,53.98 90.98,57.15 95.22,57.15 J3.2
  Bottom 0.254: v33.71,40.64 40.95,33.4 40.95,30.1 43.61,27.43 55.81,27.43 56.57,26.67 62.66,26.67 64.7,24.64 64.7,23.46 X4.11 | v73.33,30.86 73.33,50.55 v73.97,51.18
D6
  Top 0.203: U1_MLF.10 38.9,40.5 38.59,40.18 37.53,40.18 U1_TQFP.10
D7
  Top 0.203: U1_MLF.11 38.94,39.83 38.31,39.83 U1_TQFP.11
D8  (via drill 0.5)
  Top 0.203: U1_MLF.12 39.3,39.47 39.09,39.47 U1_TQFP.12 35.49,35.87 35.04,35.87 v34.47,35.31
  Bottom 0.203: 27.1,25.91 28.63,27.43 35.74,27.43 38.03,29.72 38.03,33.27 35.99,35.31 v34.47,35.31
  Bottom 0.254: 93.14,9.91 S1.2 94.6,9.98 95.18,9.4 95.18,4.57 91.87,1.27 27.1,1.27 17.45,10.92 17.45,15.49 20.5,18.54 26.34,18.54 27.1,19.3 27.1,25.91
D9  (via drill 0.5)
  Top 0.203: v27.69,34.75 33.25,34.75 33.96,34.04 34.98,34.04 38.03,37.08 38.03,37.34 38.08,37.34 U1_TQFP.13 39.65,38.91 39.65,39.12 U1_MLF.13
  Top 0.254: U1_TQFP.13 38.65,37.96 | R10.2 8.94,23.5 v12.88,27.43
  Bottom 0.254: v27.69,34.75 24.51,34.75 21.26,31.5 15.93,31.5 12.88,28.45 v12.88,27.43
D10
  Top 0.203: 33.99,32.24 26.88,32.24 | 40.01,38.76 U1_MLF.14 40.01,38.77 40.01,38.61 39.8,38.41 39.8,38 39.27,37.46 U1_TQFP.14
  Top 0.254: 33.99,32.24 39.22,37.39 U1_TQFP.14 | R1.1 1.7,49.02 2.21,48.51 4.15,48.51 U$14.SEL 6.69,48.61 11.61,43.69 23.55,43.69 25.58,41.66 25.58,33.4 26.75,32.23 26.88,32.24
D11/MOSI  (via drill 0.5)
  Top 0.203: U1_MLF.15 40.36,38.41 40.36,37.35 U1_TQFP.15
  Top 0.254: ISP1.4 29.18,33.27 26.98,33.27 26.34,33.91 26.34,40.77 27.48,41.91 27.48,44.07 26.34,45.21 12.63,45.21 5.23,52.61 U$14.SDI | U1_TQFP.15 39.8,36.83 34.72,31.75 34.72,29.21 v34.98,28.96
  Bottom 0.203: 31.8,28.96 31.8,29.08 30.69,30.23 30.69,32.21 ISP1.4
  Bottom 0.254: v34.98,28.96 31.8,28.96
D12/MISO  (via drill 0.5)
  Top 0.203: v33.96,36.58 33.96,36.83 32.69,38.1 32.69,42.16 v33.2,42.67 | U1_MLF.16 41.03,36.89 U1_TQFP.16
  Top 0.254: v36.63,31.62 36.63,32.49 U1_TQFP.16 | U$14.SDO 23.96,48.61 v30.02,42.55
  Top 0.381: U1_TQFP.16 40.38,36.26
  Bottom 0.203: ISP1.1 32.39,30.94 33.96,32.51 33.96,34.54 33.45,35.05 33.45,36.07 v33.96,36.58 | v33.2,42.67 30.15,42.67 v30.02,42.55
  Bottom 0.254: ISP1.1 35.95,30.94 v36.63,31.62
D13/SCK  (via drill 0.5)
  Top 0.203: U1_MLF.17 41.88,36.89 U1_TQFP.17
  Top 0.254: v39.42,32.38 39.42,33.17 U1_TQFP.17 | U$14.SCK 5.96,50.61 12.12,44.45 25.07,44.45 v26.09,43.43
  Bottom 0.203: 30.69,37.59 30.69,34.75
  Bottom 0.254: v26.09,43.43 26.09,42.16 30.69,37.59 35.74,37.59 39.42,33.91 v39.42,32.38 | 30.69,34.75 ISP1.3
DIG6
  Top 0.254: R29.1 9.84,67.94 R30.1
  Top 1.092: U$14.ANT arc90 9.84,66.2 R29.1
GND  (via drill 0.5)
  Top 0.203: 46.92,31.28 C7.2 | U1_MLF.5 | U1_TQFP.5 38.93,43.23 39.14,43.23 U1_MLF.5 | 40.32,43.58 U1_MLF.3 41.37,42.42 41.38,42.42 40.82,41.86 40.52,41.86 U1_MLF.5 | U1_TQFP.3 39.91,44.52 39.91,44.5 40.01,44.4 40.01,43.84 | 40.01,43.84 40.01,43.79 40.41,43.38 40.46,43.38 40.46,43.33 40.52,43.28 40.52,43.33 40.01,43.84 | U1_TQFP.21 44.56,38.52 | 42.32,40.77 42.29,40.77 42.27,40.79 42.27,40.82 42.07,41.02 U1_MLF.21
  Top 0.254: C11.2 27.27,52.24 | 40.82,41.86 41,41.86 v41.45,41.4 | C7.2 46.75,30.06 v46.15,29.46 | v65.2,32.77 61.14,32.77 v59.11,30.73 59.11,29.97 v57.33,28.19 57.33,28.45 55.68,30.1 | S1.1 93.08,2.22 92.64,1.78 82.73,1.78 v80.82,3.68 | v37.01,3.56 39.17,5.71 v48.69,5.71 50.85,3.56 65.33,3.56 v66.22,4.45 | v69.27,73.91 32.69,73.91 32.15,73.91 | v49.2,29.21 49.2,29.84 50.47,31.11 | X1.6 73.45,11.04 73.84,11.43 73.84,18.29 72.32,19.81 72.32,20.9 X4.6 | 1.49,56.9 C2.2 | LED.C 2.56,28.36 5.26,25.65 7.29,25.65 8.05,26.42 8.05,27.27 | 44.56,38.52 42.32,40.77 | JP2.1 75.11,6.88 72.58,9.41 | v15.42,21.59 16.94,20.07 18.47,20.07 18.67,19.86 U1.4 U1.3 U1.2 19.74,15.24
  Top 0.381: v28.88,47.5 28.88,45.47 31.17,43.18 31.17,37.8 ISP1.6
  Top 0.406: 37.26,47.16 37.26,48.12 C6.2 39.13,52.41 v39.3,52.58 | 34.72,60.33 36.17,61.77 C9.2 | 34.72,60.33 27.23,52.83 27.23,51.93 | v69.52,46.99 75.36,46.99 v76.13,47.75 | 27.1,52.06 27.23,51.93 | 27.23,51.93 C11.2 | v34.72,57.91 34.72,60.33 | JP3.GND 56.44,59.56 v54.03,61.98 | X1.6 72.58,9.41 72.06,8.89 67.49,8.89 66.22,7.62 v66.22,4.45 | U$7.GND 9.43,34.19 10.85,32.77 10.85,30.99 v11.61,30.23 8.69,27.3 | v23.55,23.88 23.55,26.24 U$8.1 | v29.64,69.9 27.89,69.9 27.48,69.49
  Top 0.508: C6.2 39.13,49.74 | 37.26,47.16 U1_TQFP.3 | C11.2 27.27,51.6 v25.96,50.29 | C7.2 50.47,31.11 50.73,31.11 52.38,29.46 55.04,29.46 55.68,30.1 55.68,31.08 C1.2
  Top 0.61: U$14.P$12 20.15,60.71 12.63,60.71 8.53,56.61 U$14.GND 4.21,56.64 2.72,56.64 2.47,56.9 1.49,56.9 | 30.02,73.91 32.69,73.91
  Top 0.762: C14.2 22.88,27.09 U$8.1 21.82,26.04 19.87,26.04 18.81,27.09 C15.2
  Top 0.813: 27.48,69.49 27.48,70.1 | 27.48,70.1 27.48,71.37 30.02,73.91 | OOK.GND 22.22,68.02 24.06,69.85 27.23,69.85 27.48,70.1 | U$14.P$12 21.61,60.61 24.31,57.91 24.56,57.91
  Bottom 0.203: ISP1.6 22.58,36.02 v22.53,36.07
  Bottom 0.254: v41.45,41.4 41.45,34.92 43.61,32.77 43.61,30.48 44.63,29.46 v46.15,29.46 | v76.13,47.75 76.13,48.01 | X4.6 72.33,21.07 71.05,22.35 71.05,25.65 v67.24,29.46 | JP4.2 5.13,18.41 7.29,20.57 15.17,20.57 | 15.17,20.57 17.71,20.57 18.09,20.95 | v15.42,21.59 15.42,20.83 15.17,20.57 | 80.82,5.97 v81.46,6.6
  Bottom 0.406: 80.82,5.97 v80.82,3.68 80.19,3.05 68.76,3.05 67.36,4.45 v66.22,4.45 | 95.38,70.87 J1.2 | v69.52,46.99 67.74,46.99 58.81,55.93 JP3.GND | v39.3,52.58 39.3,53.34 v34.72,57.91 38.79,61.98 v54.03,61.98 54.03,63.8 51.39,66.45 33.1,66.45 v29.64,69.9 | 18.09,20.95 21.01,23.88 v23.55,23.88 | 81.84,73.03 v81.71,72.9 | 88.91,48.42 76.8,48.42 v76.13,47.75 | 89.19,48.42 88.91,48.42 | 88.91,48.42 87.05,50.29 87.05,57.15 86.03,58.17 84.53,58.17 U$13.5
  Bottom 0.508: v25.96,50.29 25.96,49.96 | v67.24,29.46 67.24,30.73 v65.2,32.77
  Bottom 1.016: J4.1 94.55,45.17 J4.2 89.19,48.42
  other vias: 17.43,7.57 75.11,71.12 17.96,24.38 14.15,39.62 43.11,41.4 39.93,41.4 57.08,40.13 66.6,40.13 57.71,36.96 5.01,63.63 3.74,62.99 5.01,72.52 3.74,73.79 8.18,69.34 7.55,64.26 15.8,62.99 18.98,63.63 24.89,68.23 24.31,58.17 5.64,73.79 2.72,44.07 5.26,28.83 8.44,27.56
  pour Top (isolate 0.254): 0.18,0 99.24,0 99.24,75.56 0.18,75.56 0.18,0.64
  pour Bottom (isolate 0.254): 0.18,0 98.6,0 98.6,75.56 0.18,75.56
GP18  (via drill 0.5)
  Top 0.203: v42.09,26.67 27.36,26.67 26.09,25.4 v25.33,25.4 | v25.07,31.75 25.07,32.26 24.56,32.77 24.56,41.4 23.04,42.93 14.91,42.93 v14.15,42.16 | v19.99,64.77 19.99,67.85 OOK.DATA
  Top 0.254: X1.12 65.83,11.04 66.22,11.43 66.22,17.78 64.7,19.3 64.7,20.9
  Top 0.305: 64.7,20.9 X4.12
  Bottom 0.203: 64.71,21.07 63.43,22.35 63.43,24.89 62.92,25.4 43.36,25.4 v42.09,26.67 | v25.33,25.4 25.33,31.5 v25.07,31.75 | v14.15,42.16 14.15,46.23 15.17,47.24 22.53,47.24 23.04,47.75 23.04,58.17
  Bottom 0.254: X4.12 64.71,21.07 | 23.04,58.17 23.04,58.42 21.01,60.45 20.75,60.71 19.99,61.47 v19.99,64.77
GP23
  Top 0.254: X4.16 59.62,20.9 59.62,19.05 61.14,17.53 61.14,11.43 60.75,11.04 X1.16 59.87,11.03 59.87,10.16 62.41,7.62 JP2.6
ID_SC  (via drill 0.5)
  Top 0.254: R8.2 10.94,15.46 11.99,16.51 U1.6 14.78,16.51 16.82,14.48 16.82,13.21 18.09,11.94 v19.61,11.94 | X4.28 44.38,20.9 44.38,19.56 45.9,18.03 45.9,11.43 45.51,11.04 X1.28 44.64,9.41 42.6,7.37 27.87,7.37 v25.83,9.4
  Bottom 0.254: v25.83,9.4 21.52,9.4 v19.61,11.94
ID_SD  (via drill 0.5)
  Top 0.254: R9.2 10.38,19.3 10.97,19.3 11.48,18.8 11.48,18.29 11.99,17.78 U1.5 13.44,18.87 12.12,20.19 12.12,21.59 13.39,22.86 17.71,22.86 19.48,21.08 v19.48,20.07 | v26.09,20.07 26.09,24.13 27.61,25.65 43.36,25.65 44.39,24.62 X4.27 43.11,22.17 43.11,19.56 44.64,18.02 X1.27
  Bottom 0.254: v19.48,20.07 v26.09,20.07
N$1
  Top 0.203: U1_MLF.7 38.91,42.09 38.59,42.42 37.48,42.42 U1_TQFP.7
  Top 0.508: U1_TQFP.7 34.22,45.69 34.22,49.4 39.15,54.34 Q1.2 39.15,61.75 C9.1
N$2
  Top 0.203: U1_MLF.8 37.07,41.7 U1_TQFP.8
  Top 0.508: U1_TQFP.8 36.44,42.35 31.8,46.99 31.8,50.67 Q1.1 30.9,51.2 30.15,51.94 29.02,51.94 C11.1
N$3
  Top 0.381: 81.33,31.84 R21.1 C3.1
  Top 0.762: R23.1 82.94,35.5 | 82.94,35.5 R17.1 | 82.94,35.5 82.94,35.01 81.21,33.27 81.21,31.79 R21.1
  Top 1.27: R22.1 R17.1 85.37,33.27 86.54,33.27 87.81,34.54 87.81,36.07 89.37,37.63 CT2.5
N$4
  Top 0.381: R13.1 C8.1
N$5  (via drill 0.5)
  Top 0.381: R4.2 62.16,35.56 v62.66,36.07 | 84.76,45 R13.2 | v64.19,43.94 74.35,43.94 v75.87,45.47 | v86.79,46.99 86.75,46.99 R14.1
  Top 0.508: R14.1 R13.2
  Bottom 0.381: v62.66,36.07 62.66,42.42 v64.19,43.94 | 86.54,46.74 v86.79,46.99 78.92,46.99 77.4,45.47 v75.87,45.47
N$12
  Top 0.483: R28.2 85.27,19.3 83.49,17.53 80.95,17.53 79.94,18.54 79.94,27.18 68.51,38.61 54.5,38.61 R3.2
  Top 0.813: R26.2 R28.2
  Top 1.27: CT1.1 87.53,19.58 87.05,20.07 85.42,20.07 R28.2
N$14
  Top 0.254: ANT1.1 9.83,71.88
  Top 1.016: 9.32,71.88 arc-90 9.74,71.47 R30.2
  Top 1.422: OOK.ANT arc90 10.88,71.88 9.83,71.88 9.32,71.88
N$15
  Top 0.508: R27.1 81.24,23.58 81.97,22.86 85.17,22.86 R28.1
  Top 0.762: R27.1 R25.1 C4.1
  Top 1.27: R26.1 R28.1 86.44,22.76 88.32,24.64 90.93,24.64 CT1.5
N$16
  Top 0.406: U$7.VBUS 10.55,37.38 13.13,34.8 13.13,34.62 F1.2
N$17
  Top 0.508: R2.2 68,41.91 69.01,40.89 69.01,39.88 79.43,29.46 79.43,28.96 81.21,27.18 83.75,27.18 85.27,28.7
  Top 1.27: R22.2 85.27,28.7 R17.2 87.15,30.33 89.33,32.51 95.97,32.51 CT2.1
N$18
  Top 1.016: C8.2 85.95,41.27 J4.3
N$20
  Top 0.203: U1_MLF.20 43.26,39.12 43.26,38.91 U1_TQFP.20
  Top 0.254: C1.1 53.94,31.33 51.87,33.4 48.76,33.4 U1_TQFP.20
N$24
  Top 1.016: 5,67.92 arc-90 J$1.SIG
  Top 1.092: R29.2 5,67.92
N$32
  Top 0.254: X4.13 60.89,22.17 60.89,19.3 62.42,17.77 X1.13
N$33
  Top 0.254: X4.15 58.35,22.17 58.35,19.3 59.88,17.77 X1.15
N$34
  Top 0.254: R12.2 79.34,45.38 80.95,46.99 80.95,48.81 R11.1
  Top 0.381: C10.1 R12.2 | R14.2 R11.1
N$36
  Top 0.254: X1.18 57.95,11.04 58.6,11.68 58.6,17.78 57.08,19.3 57.08,20.9 X4.18
N$37
  Top 0.254: X1.22 53.13,11.04 53.52,11.43 53.52,17.53 52,19.05 52,20.9 X4.22
N$41
  Top 0.254: LED.A 2.12,26.25 5.01,23.37 6.19,23.37 R10.1
N$42
  Top 0.254: X1.19 54.8,17.52 53.27,19.05 53.27,22.17 X4.19
N$43
  Top 0.254: X4.21 50.73,22.17 50.73,19.3 52.25,17.78 52.25,16.76 X1.21
N$44
  Top 0.254: X1.23 49.72,18.02 48.19,19.56 48.19,22.17 X4.23
N$45
  Top 0.254: X1.24 50.59,11.04 50.98,11.43 50.98,17.78 49.46,19.3 49.46,20.9 X4.24
N$46
  Top 0.254: X1.26 48.05,11.04 48.44,11.43 48.44,17.78 46.92,19.3 46.92,20.9 X4.26
N$47  (via drill 0.5)
  Top 0.254: X1.4 75.12,10.15 v75.87,9.4
  Bottom 0.254: v75.87,9.4 74.35,9.4 73.84,9.91 73.84,18.29 74.86,19.3 74.86,20.9 X4.4
N$48
  Top 0.254: X4.9 65.97,22.17 65.97,19.56 67.5,18.02 X1.9
N$49
  Top 0.254: X1.14 63.29,11.04 63.68,11.43 63.68,17.78 62.16,19.3 62.16,20.9 X4.14
N$50
  Top 0.254: X1.17 57.34,17.52 55.81,19.05 55.81,22.17 X4.17
N$51
  Top 0.254: X1.20 55.92,11.04 56.06,11.18 56.06,17.53 54.54,19.05 54.54,20.9 X4.20
N$52
  Top 0.254: X1.25 47.18,18.02 45.65,19.56 45.65,22.17 X4.25
N$55
  Top 0.254: X1.29 42.1,17.77 40.57,19.3 40.57,22.17 X4.29
N$56
  Top 0.254: X4.31 38.03,22.17 38.03,19.56 39.56,18.02 X1.31
N$57
  Top 0.254: X1.32 39.67,11.04 40.82,12.19 40.82,18.03 39.3,19.56 39.3,20.9 X4.32
N$58
  Top 0.254: X4.33 35.49,22.17 35.49,19.56 37.02,18.02 X1.33
N$59
  Top 0.254: X4.35 32.95,22.17 32.95,19.56 34.48,18.02 X1.35
N$60
  Top 0.254: X1.36 34.59,11.04 35.74,12.19 35.74,18.03 34.22,19.56 34.22,20.9 X4.36
N$61
  Top 0.254: X1.37 31.94,17.26 30.41,18.8 30.41,22.17 X4.37
N$62
  Top 0.254: X1.38 32.3,11.04 33.2,11.94 33.2,17.78 31.68,19.3 31.68,20.9 X4.38
  Bottom 0.254: 31.68,20.9 X4.38
N$63  (via drill 0.5)
  Top 0.254: X1.40 v29.4,8.9 v29.39,8.89
  Bottom 0.254: v29.39,8.89 29.39,9.14 28.37,10.16 28.37,18.54 29.14,19.3 29.14,20.9 X4.40
N$64
  Top 0.254: X1.30 42.97,11.04 43.36,11.43 43.36,17.78 41.84,19.3 41.84,20.9 X4.30
N$65
  Top 0.254: X1.34 37.63,11.04 38.28,11.68 38.28,18.03 36.76,19.56 36.76,20.9 X4.34
N$66
  Top 0.254: X1.39 29.4,17.26 27.61,19.05 27.61,21.91 X4.39
N$67  (via drill 0.5)
  Top 0.254: R6.2 13.3,10.38 13.77,9.91 15.8,9.91 16.31,10.41 16.31,13.97 15.04,15.24 U1.7 | v13.26,8.64 13.26,11.39 R6.2 | JP4.1 9.32,11.18 13.05,11.18 R6.2
PI_3V3  (via drill 0.5)
  Top 0.254: X1.1 77.66,17.77 76.13,19.3 76.13,22.17 X4.1 78.67,24.71 v78.67,26.67
  Bottom 0.254: JP2.5 64.95,3.05 66.22,1.78 85.52,1.78 89.33,5.59 89.33,10.16 88.32,11.18 88.32,22.1 86.54,23.88 81.46,23.88 v78.67,26.67
RESET  (via drill 0.5)
  Top 0.203: U1_MLF.29 43.36,43.54 43.36,43.75 U1_TQFP.29
  Top 0.254: 44.27,44.59 U1_TQFP.29 46.35,46.74 v46.79,46.74 | C5.1 v44,48.77 | R7.1 47.17,49.28 v47.04,49.15 | ISP1.5 v31.93,44.58
  Bottom 0.254: 44.5,48.77 v44,48.77 39.8,44.58 v31.93,44.58 | 44.5,48.77 44.76,48.77 v46.79,46.74 | v47.04,49.15 44.88,49.15 44.5,48.77
SCL  (via drill 0.5)
  Top 0.203: U1_MLF.28 43.72,43.18 43.93,43.18 U1_TQFP.28
  Top 0.254: v75.11,27.43 72.32,24.64 72.33,24.62 X4.5 71.05,22.17 71.05,19.56 72.58,18.02 X1.5 | U1_TQFP.28 45.7,44.96 49.96,44.96 50.98,43.94 55.68,43.94 56.57,43.05 69.39,43.05 69.78,42.67 v75.62,42.67
  Bottom 0.254: v75.11,27.43 75.11,42.16 v75.62,42.67 | X4.5 73.61,22.22 73.61,19.58 72.82,18.8 71.81,18.8 71.3,18.29 71.3,10.16 JP2.4
SDA  (via drill 0.5)
  Top 0.203: U1_MLF.27 43.65,42.45 43.97,42.77 44.65,42.77 U1_TQFP.27
  Top 0.254: v76.63,27.43 74.86,25.65 74.87,25.64 X4.3 73.61,22.17 73.61,19.56 75.12,18.02 X1.3 | v76.13,41.27 70.16,41.27 68.89,42.55 55.81,42.55 54.92,43.43 49.71,43.43 48.69,44.45 46.33,44.45 U1_TQFP.27
  Bottom 0.254: v76.13,41.27 76,41.15 76,35.43 76.63,34.8 v76.63,27.43 76.63,26.16 | JP2.3 72.57,3.81 77.14,3.81 82.98,9.65 84.51,9.65 87.05,12.19 87.05,21.08 86.54,21.59 82.48,21.59 77.65,26.42 76.89,26.42 76.63,26.16 | 76.63,26.16 74.86,24.38 74.86,23.46 X4.3

### Text on the board
Bottom: OpenEnergyMonitor.org
tNames: one-wire | RFM69CW | IRQ0 / D2 / RJ45 pin2 | D4 | IRQ1 | D3 | ADC6 | Dig20 | 2.1mm | G26 | G19 | G13 | G06 | G05 | ID_SD | GND | SCK | MISO | MOSI | 3V3 | G22 | !G27 | G21 | G17 | GND | G04 | SCL | SDA | 3V3 | IDSC | G21 | G20 | G16 | G12 | CE1 | CE0 | G25 | GND | G24 | G23 | GND | G18 | RXD | TXD | GND | 5V0 | 5V0 | X1 | SCL | 5V | GND | SDA | LCD / Push Button | LCD I2C
bNames: Lead free PCB / RoHS components | OpenEnergyMonitor.org | GND | 5V | IRQ1 | D3 | emonPi | D4 | one / wire | D5 | GPIO17 | Raspberry Pi / Energy Monitoring | D20 | ADC6 | 915Mhz | 78mm | 868Mhz | 82mm | 433Mhz | 165mm | Technology that helps us / live within / ecological limits | SCL | 5V | GND | SDA | GPIO / 23 | LCD / Push Button | LCD I2C | Designed by Glyn Hudson & Trystan Lea
tSilk: emonPi | RaspberryPi Energy Monitoring | GND | V1.6 / Jun 2015 | OKK Tx | Ant | 5V | GP18 | OpenEnergyMonitor.org | ATmega328 UART | RST | RX | TX | NC | NC | GND | 9VAC | 5V DC | CT2 | + | Activity | Dig9 | ID EEPROM | CT1 | R/W | RaspberryPi / Shutdown | Designed in | North Wales | Made in UK
_tsilk: Designed in | North Wales | Made in UK
_bsilk: 165mm ant | 433Mhz | 165mm ant | 165mm ant | 433Mhz | 433Mhz | 868Mhz | 82mm ant | 82mm ant | 82mm ant | 868Mhz | 868Mhz | 78mm ant | 915Mhz | 78mm ant | 915Mhz | 78mm ant | 915Mhz | 165mm ant | 433Mhz | 82mm ant | 868Mhz | 78mm ant | 915Mhz